# EasyEDA Pro project backup.epro, board PCB
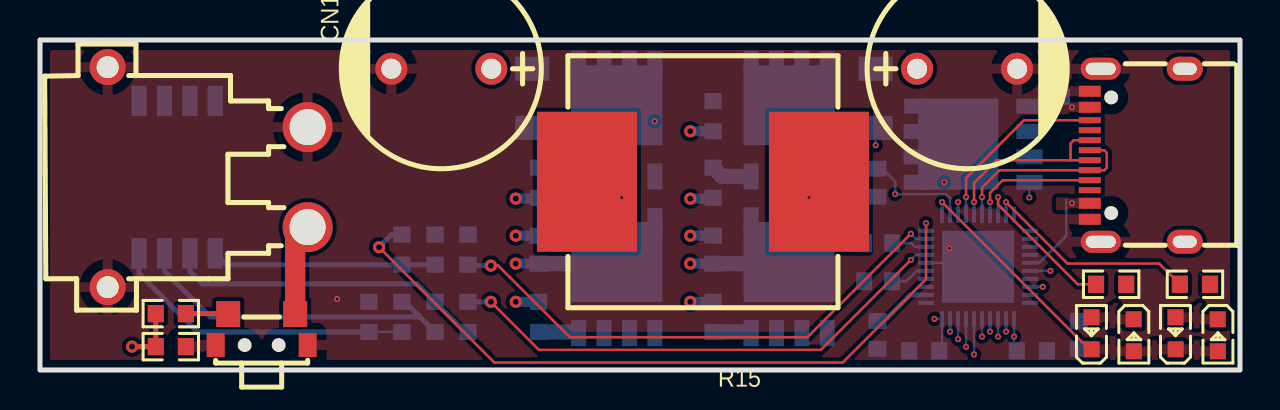
[diagram p16: board, top side]
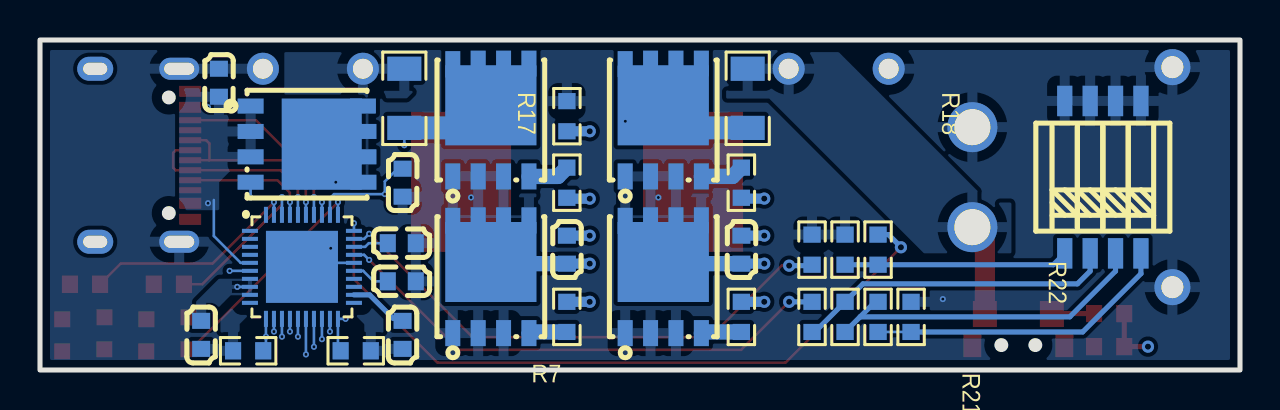
[diagram p17: board, bottom side, seen from below]

Outline 60 x 16.5 mm; copper layers: Top Layer, VCC/SIGANL, GND, Bottom Layer. Coordinates in mm from the lower left corner of the outline.
Outline path: rectangle 0,16.5 60,0
Stack: Top Layer 0.035mm 外层铜厚1oz / Dielectric1 0.2104mm 7628 RC49% 8.6mil / VCC/SIGANL 0.0152mm 内层铜厚 / Dielectric2 1.065mm 1.1mm H/HOZ 含铜 / GND 0.0152mm 内层铜厚 / Dielectric3 0.2104mm 7628 RC49% 8.6mil / Bottom Layer 0.035mm 外层铜厚1oz

## Design rules (mm)
template: 自定义配置
spacing copperThickness1oz: track to track 0.102, other pairs 0.152 to 0.3
spacing copperThickness2oz: track to track 0.203, other pairs 0.152 to 0.3
spacing 6mil (default): track to track 0.102, other pairs 0.152 to 0.152
track width copperThickness1oz (default): min 0.127, default 0.254, max 2.54
track width copperThickness2oz: min 0.203, default 0.254, max 2.54
track width 10mil: min 0.254, default 0.254, max 2.54
track width 20mil: min 0.508, default 0.508, max 2.54
differential pair differentialPair (default): width min 0.127, default 0.254, max 2.54; gap min 0.152, default 0.152
differential pair err=5mil: width min 0.127, default 0.254, max 2.54; gap min 0.152, default 0.254
via viaSize: diameter min 0.5, default 0.61, max 10; hole min 0.3, default 0.305, max 6.299
via 12-24: diameter min 0.5, default 0.61, max 10; hole min 0.3, default 0.305, max 6.299
via 6-12 (default): diameter min 0.305, default 0.305, max 10; hole min 0.152, default 0.152, max 6.299

## Placement (name value [footprint] x y rotation side)
C20  2.2uF  [C0603]  41.91 4.44 180 bottom
C22  100nF  [C0603]  41.87 9.37 270 bottom
C23  2.2uF  [C0603]  41.91 6.34 180 bottom
C29  470nF  [C0603]  51.94 1.76 90 bottom
C30  470nF  [C0603]  41.87 1.76 90 bottom
C35  1000uF  [CAP-TH_BD10.0-P5.00-D0.6-FD-A]  46.35 15.06 0 top
C36  470nF  [C0603]  33.66 6.02 270 bottom
C37  470nF  [C0603]  24.93 6.02 270 bottom
C38  1000uF  [CAP-TH_BD10.0-P5.00-D0.6-FD-A]  20.07 15.06 180 top
C39  22uF  [C0603]  51.05 14.36 270 bottom
CN1  XT30PW-M  [CONN-TH_XT30PW-M]  8.38 9.64 270 top
L1  10uH  [IND-SMD_L12.6-W13.5]  33.15 9.41 180 top
LED1  NCD0603R1  [LED0603-RD_RED]  52.58 1.83 90 top
LED2  NCD0603R1  [LED0603-RD_RED]  54.69 1.73 270 top
LED3  NCD0603R1  [LED0603-RD_RED]  56.78 1.83 90 top
LED4  NCD0603R1  [LED0603-RD_RED]  58.89 1.73 270 top
Q2  BSC0702LS  [PG-TDSON-8_L5.0-W6.0-P1.27-BL-EP]  46.65 11.29 270 bottom
Q3  BSC0702LS  [PG-TDSON-8_L5.0-W6.0-P1.27-BL-EP]  37.46 12.5 180 bottom
Q4  BSC0702LS  [PG-TDSON-8_L5.0-W6.0-P1.27-BL-EP]  28.84 4.66 180 bottom
Q5  BSC0702LS  [PG-TDSON-8_L5.0-W6.0-P1.27-BL-EP]  37.46 4.66 180 bottom
Q6  BSC0702LS  [PG-TDSON-8_L5.0-W6.0-P1.27-BL-EP]  28.84 12.5 180 bottom
R7  51Ω  [R0603]  49.59 0.96 0 bottom
R8  5mΩ  [R1206]  41.78 13.58 270 bottom
R9  10Ω  [R0603]  44.21 0.96 180 bottom
R10  5mΩ  [R1206]  24.62 13.58 90 bottom
R11  100Ω  [R0603]  53.56 4.29 0 top
R12  100Ω  [R0603]  57.75 4.29 0 top
R15  43kΩ  [R0603]  6.54 2.82 180 top
R16  10kΩ  [R0603]  6.54 1.17 180 top
R17  27kΩ  [R0603]  21.4 6.02 90 bottom
R18  3.6K  [R0603]  18.1 6.02 270 bottom
R19  5.5K  [R0603]  19.75 6.02 90 bottom
R20  6.2K  [R0603]  21.4 2.66 270 bottom
R21  2.9K  [R0603]  19.75 2.66 270 bottom
R22  4.9K  [R0603]  18.1 2.66 270 bottom
R23  5K  [R0603]  16.45 2.66 90 bottom
R24  NCP18XH103F03RB  [R0603]  33.66 12.69 90 bottom
R25  2Ω  [R0603]  33.66 9.37 90 bottom
R26  2Ω  [R0603]  33.66 2.66 270 bottom
R27  2Ω  [R0603]  24.93 9.37 270 bottom
R28  2Ω  [R0603]  24.93 2.66 90 bottom
SW1  TS24CA  [SW-SMD_TS24CA]  11.08 2.02 180 top
SW2  DSHP04TSGET  [SW-SMD_8P-L6.7-W5.4-P1.27-LS8.4]  6.86 9.64 180 bottom
U1  -  [IP2366]  49.4 2.66 180 bottom
USB1  TYPE-C 16PIN 2MD(073)  [USB-C-SMD_TYPE-C-6PIN-2MD-073]  54.86 10.74 90 top

## Footprints (pads in the part's own frame, mm; a bottom-side part is the same pattern mirrored in y, then rotated)
C0603
  rect 0.8x0.9 smd: 1(-0.7,0) 2(0.7,0)
CAP-TH_BD10.0-P5.00-D0.6-FD-A
  round 1.6 hole 1: 1(-2.5,0) 2(2.5,0)
CONN-TH_XT30PW-M
  round 2.5 hole 1.8: 1(-2.5,5) 2(2.5,5)
  round 1.8 hole 1.1: 3(5.5,-5) 4(-5.5,-5)
IND-SMD_L12.6-W13.5
  rect 5x7 smd: 1(-5.8,0) 2(5.8,0)
IP2366
  rect 0.8x0.2 smd: 1(-0.1,4.3) 2(-0.1,3.9) 3(-0.1,3.5) 4(-0.1,3.1) 5(-0.1,2.7) 6(-0.1,2.3) 7(-0.1,1.9) 8(-0.1,1.5) 9(-0.1,1.1) 10(-0.1,0.7) 21(5.1,0.7) 22(5.1,1.1) 23(5.1,1.5) 24(5.1,1.9) 25(5.1,2.3) 26(5.1,2.7) 27(5.1,3.1) 28(5.1,3.5) 29(5.1,3.9) 30(5.1,4.3)
  rect 0.2x0.8 smd: 11(0.7,-0.1) 12(1.1,-0.1) 13(1.5,-0.1) 14(1.9,-0.1) 15(2.3,-0.1) 16(2.7,-0.1) 17(3.1,-0.1) 18(3.5,-0.1) 19(3.9,-0.1) 20(4.3,-0.1) 31(4.3,5.1) 32(3.9,5.1) 33(3.5,5.1) 34(3.1,5.1) 35(2.7,5.1) 36(2.3,5.1) 37(1.9,5.1) 38(1.5,5.1) 39(1.1,5.1) 40(0.7,5.1)
  rect 3.6x3.6 smd: 41(2.5,2.5)
LED0603-RD_RED
  rect 0.8x0.8 smd: 1(-0.799,-0.004) 2(0.799,0.004)
PG-TDSON-8_L5.0-W6.0-P1.27-BL-EP
  rect 0.75x1.3 smd: 1(-1.905,-2.82) 2(-0.635,-2.82) 3(0.635,-2.82) 4(1.905,-2.82) 5(1.905,2.82) 6(0.635,2.82) 7(-0.635,2.82) 8(-1.905,2.794)
  rect 4.56x4 smd: 8(0,0.737)
R0603
  rect 0.806x0.864 smd: 1(-0.753,0) 2(0.753,0)
R1206
  rect 1.208x1.701 smd: 1(-1.479,0) 2(1.479,0)
SW-SMD_8P-L6.7-W5.4-P1.27-LS8.4
  rect 0.762x1.524 smd: 1(-1.905,-3.81) 2(-0.635,-3.81) 3(0.635,-3.81) 4(1.905,-3.81) 5(1.905,3.81) 6(0.635,3.81) 7(-0.635,3.81) 8(-1.905,3.81)
SW-SMD_TS24CA
  rect 0.9x1.2 smd: 1(-2.3,0.775) 2(2.3,0.775)
  rect 1.2x1.3 smd: 3(-1.675,-0.775) 4(1.675,-0.775)
USB-C-SMD_TYPE-C-6PIN-2MD-073
  rect 0.55x1.1 smd: 1(-3.2,2.375) 2(-2.4,2.375) 11(2.4,2.375) 12(3.2,2.375)
  rect 0.3x1.1 smd: 3(-1.75,2.375) 4(-1.25,2.375) 5(-0.75,2.375) 6(-0.25,2.375) 7(0.25,2.375) 8(0.75,2.375) 9(1.25,2.375) 10(1.75,2.375)
  oval 1.1x2 hole 0.6x1.5: 13(-4.325,1.825) 14(4.325,1.825)
  oval 1.2x1.8 hole 0.6x1.2: 13(-4.325,-2.375) 14(4.325,-2.375)

## Nets
As in the schematic, except:
$C30_2: C30.2 U1.22 U1.23
BAT: C38.1 CN1.2 R10.2 SW1.3

Pads without a net: U1 1 2 3 4 24 40; USB1 3 9

## Via types
v1: diameter 0.305, hole 0.152, Top Layer to Bottom Layer, 34 vias
v2: diameter 0.61, hole 0.305, Top Layer to Bottom Layer, 13 vias

## Routing (per net, layer and track width the routed paths; a pad name or vN(x,y) marks a point on that pad's centre or on a via; arc(x,y) is an arc through that point)
GND: length 2.7
  Bottom Layer w0.127: U1.41 46.7,5.36 U1.26
  vias: v1(14.86,3.55) v1(45.47,6.09)
VBUS: length 4.2
  Bottom Layer w0.127: 51.31,8.5 51.31,6.7 49.97,5.36 U1.5
  vias: v1(51.6,13.14) v1(51.6,8.34)
3S: length 16.1
  Bottom Layer w0.254: SW2.2 7.49,4.94 8.13,4.31 18.85,4.31 R21.1 21.25,1.9 R20.2
4S: length 16.9
  Bottom Layer w0.254: 18.99,2.66 8.51,2.66 6.22,4.94 SW2.3 ; 18.99,2.66 18.24,3.41 R22.1 ; 18.99,2.66 R21.2
5S: length 15.4
  Bottom Layer w0.127: R23.1 R22.2
  Bottom Layer w0.254: R23.1 7.87,1.9 4.95,4.82 SW2.4
$C20_1: length 1.9
  Bottom Layer w0.127: C20.1 43.32,4.44 43.84,4.96 U1.25
$C23_1: length 1.8
  Bottom Layer w0.127: C23.1 43.56,6.34 43.74,6.16 U1.28
$C29_2: length 9.5
  VCC/SIGANL w0.127: v1(45.21,9.39) 47.88,9.39 50.14,7.13 v1(50.14,4.16)
  Bottom Layer w0.127: v1(50.14,4.16) U1.8
$C30_2: length 2.9
  Bottom Layer w0.254: U1.22 43.52,3.76 42.35,2.58 41.87,2.58
$C36_1: length 20.4
  VCC/SIGANL w0.127: v2(32.51,6.72) 32.51,6.05 34.64,3.93 46.48,3.93 47.9,2.51 v1(47.9,1.67)
  Bottom Layer w0.127: v1(47.9,1.67) U1.13
  Bottom Layer w0.508: v2(32.51,6.72) C36.1
$C36_2: length 22.5
  VCC/SIGANL w0.127: v2(32.51,5.32) 32.51,4.82 33.78,3.55 46.23,3.55 47.5,2.27 v1(47.5,1.92)
  Bottom Layer w0.127: v1(47.5,1.92) U1.14
  Bottom Layer w0.508: C36.2 v2(32.51,5.32)
  Bottom Layer w0.762: Q5.8 37.38,5.32 C36.2
  vias: v1(38.45,8.63)
$C37_1: length 26.8
  VCC/SIGANL w0.127: v2(23.79,6.72) 23.79,6.05 28.3,1.54 v1(45.9,1.54)
  Bottom Layer w0.127: v1(45.9,1.54) U1.18
  Bottom Layer w0.508: v2(23.79,6.72) C37.1
$C37_2: length 31
  VCC/SIGANL w0.127: v2(23.79,5.32) 23.79,4.78 27.41,1.16 v1(46.3,1.16)
  Bottom Layer w0.127: v1(46.3,1.16) U1.17
  Bottom Layer w0.508: v2(23.79,5.32) C37.2
  Bottom Layer w0.762: Q4.8 28.75,5.32 C37.2
  vias: v1(29.08,8.63)
$Q2_4: length 5.9
  VCC/SIGANL w0.127: v1(49.47,8.63) 50.52,7.58 v1(50.52,4.96)
  Bottom Layer w0.127: U1.6 v1(50.52,4.96) ; v1(49.47,8.63) Q2.4
$Q3_4: length 2.1
  Bottom Layer w0.762: R25.2 34.1,9.68 Q3.4
$Q3_5: length 19.6
  VCC/SIGANL w0.127: v1(41.78,11.24) 41.78,10.79 48.7,3.87 v1(48.7,1.67)
  Bottom Layer w0.127: v1(41.78,11.24) R8.2 ; 48.84,1.09 48.7,1.23 v1(48.7,1.67) U1.11
  Bottom Layer w1.143: Q3.8 38.59,12.1 R8.2
$Q4_4: length 2
  Bottom Layer w0.762: 26.93,1.84 26.87,1.9 R28.1
$Q5_4: length 1.9
  Bottom Layer w0.762: R26.2 35.49,1.9 35.55,1.84
$Q6_4: length 2.2
  Bottom Layer w0.762: R27.1 25.37,9.68 Q6.4
$Q6_5: length 29.5
  VCC/SIGANL w0.127: v1(30.73,12.44) 31.88,11.29 31.88,3.31 32.63,2.56 v1(44.72,2.56)
  Bottom Layer w0.127: R9.1 45.1,1.1 U1.20 v1(44.72,2.56)
  Bottom Layer w1.143: R10.1 27.71,12.1 Q6.8
$R15_1: length 2.1
  Top Layer w0.254: R15.1 9.39,2.82 SW1.4
$R17_1: length 26.7
  Top Layer w0.127: v2(22.54,5.22) 22.91,5.22 26.49,1.64 38.37,1.64 v1(43.54,6.81)
  Bottom Layer w0.127: U1.29 43.79,6.56 v1(43.54,6.81)
  Bottom Layer w0.254: v2(22.54,5.22) 21.45,5.22 R17.1
BAT: length 4.6
  Top Layer w1.016: CN1.2 12.76,6.52 SW1.3
BAT_NUM: length 25.9
  Top Layer w0.127: v1(43.54,5.5) 39.04,1.01 24.94,1.01 v2(22.54,3.41)
  Bottom Layer w0.127: v1(43.54,5.5) 43.79,5.76 U1.27
  Bottom Layer w0.254: v2(22.54,3.41) R20.1
CC1: length 6.3
  Top Layer w0.127: v1(47.5,8.39) 47.5,8.86 48.13,9.49 USB1.4
  Bottom Layer w0.127: v1(47.5,8.39) U1.37
CC2: length 9.2
  Top Layer w0.127: v1(46.3,8.65) 46.3,9.59 49.2,12.49 USB1.10
  Bottom Layer w0.127: v1(46.3,8.65) U1.34
DM: length 9.7
  Top Layer w0.127: USB1.7 53.21,10.99 53.34,10.86 53.34,10.11 53.21,9.99 USB1.5 47.97,9.99 47.1,9.12 v1(47.1,8.65)
  Bottom Layer w0.127: v1(47.1,8.65) U1.36
DP: length 9.7
  Top Layer w0.127: v1(46.7,8.39) 46.7,9.36 47.84,10.49 51.53,10.49 ; 51.53,10.49 51.53,11.33 51.69,11.49 USB1.8 ; 51.53,10.49 USB1.6
  Bottom Layer w0.127: v1(46.7,8.39) U1.35
EN: length 57.3
  Top Layer w0.254: R15.2 R16.2 v2(4.6,1.17)
  VCC/SIGANL w0.127: v2(4.6,1.17) 5.27,0.5 10.92,0.5 11.05,0.37 48.51,0.37 49.15,1.01 49.15,5.15 v1(45.9,8.39)
  Bottom Layer w0.127: v1(45.9,8.39) U1.33
HG1: length 21.5
  VCC/SIGANL w0.127: v1(48.3,1.92) 48.3,2.74 46.74,4.31 35.66,4.31 32.51,7.45 v2(32.51,8.57)
  Bottom Layer w0.127: v1(48.3,1.92) U1.12
  Bottom Layer w0.508: v2(32.51,8.57) 33.61,8.57 R25.1
HG2: length 26.9
  VCC/SIGANL w0.127: v2(23.79,8.57) 23.79,7.45 29.32,1.92 v1(45.5,1.92)
  Bottom Layer w0.127: v1(45.5,1.92) U1.19
  Bottom Layer w0.508: R27.2 24.89,8.57 v2(23.79,8.57)
LED1: length 11
  Top Layer w0.127: R12.1 55.96,5.32 51.37,5.32 v1(48.3,8.39)
  Bottom Layer w0.127: v1(48.3,8.39) U1.39
LED2: length 7.8
  Top Layer w0.127: R11.1 51.89,4.29 47.9,8.27 v1(47.9,8.65)
  Bottom Layer w0.127: v1(47.9,8.65) U1.38
LED3: length 11.2
  Top Layer w0.127: 52.58,1.03 52.46,1.03 v1(45.1,8.39)
  Bottom Layer w0.127: U1.31 v1(45.1,8.39)
LG1: length 17.6
  VCC/SIGANL w0.127: v2(32.51,3.41) 32.76,3.17 45.97,3.17 47.1,2.04 v1(47.1,1.67)
  Bottom Layer w0.127: v1(47.1,1.67) U1.15
  Bottom Layer w0.508: v2(32.51,3.41) R26.1
LG2: length 26.9
  VCC/SIGANL w0.127: v2(23.79,3.41) 26.42,0.78 v1(46.7,0.78)
  Bottom Layer w0.127: v1(46.7,0.78) U1.16
  Bottom Layer w0.508: v2(23.79,3.41) R28.2
NTC: length 25
  VCC/SIGANL w0.127: v1(42.76,8.8) 42.76,5.54 41.91,4.69 37.13,4.69 32.51,9.31 v2(32.51,11.94)
  Bottom Layer w0.127: C22.1 42.12,10.07 42.76,9.43 v1(42.76,8.8) ; U1.32 45.5,8.59 45.3,8.79 42.76,8.79
  Bottom Layer w0.508: v2(32.51,11.94) R24.1
SET: length 11.2
  Bottom Layer w0.254: R19.1 R18.2 9.33,5.26 SW2.1
VSET: length 36.1
  Top Layer w0.127: v1(44.3,7.34) 44.3,4.54 40.13,0.37 22.72,0.37 v2(16.95,6.14)
  Bottom Layer w0.127: U1.30 v1(44.3,7.34)
  Bottom Layer w0.254: v2(16.95,6.14) 16.95,6.15 17.58,6.77 R18.1

## Copper pours and planes (outline as drawn; the poured copper is in the pictures)
GND on Top Layer: -5.21,22.34 61.98,22.34 61.98,-2.68 -5.21,-2.68
GND on Bottom Layer: -3.81,21.71 62.74,21.71 62.74,-3.82 -3.81,-3.82
VBUS on Top Layer: 50.8,13.43 53.09,13.43 53.09,12.79 50.8,12.79
VBUS on Top Layer: 50.8,8.63 53.09,8.63 53.09,7.99 50.8,7.99
VBUS on Bottom Layer: 48.77,14.08 53.04,14.08 53.04,7.99 51.04,7.99 51.04,9.4 50.16,10.28 48.77,10.28
$C29_1 on Bottom Layer: 50.02,2.29 49.59,2.72 49.07,2.72 49.07,3.36 50.16,3.36 50.98,2.55 50.98,1.62 52.66,1.62 52.66,0.3 50.02,0.3
$C29_2 on Bottom Layer: 40.7,15.89 40.7,14.53 41.66,13.58 43.21,13.58 43.21,9.01 47.79,9.01 47.79,15.89
$C29_2 on Bottom Layer: 49.02,4.56 51.05,4.56 52.65,2.96 52.65,2.16 51.23,2.16 51.23,2.96 50.46,3.74 49.02,3.74
$C30_1 on Bottom Layer: 43.79,2.29 44.21,2.72 44.73,2.72 44.73,3.36 43.64,3.36 42.83,2.55 42.83,1.62 41.15,1.62 41.15,0.3 43.79,0.3
$C36_2 on Bottom Layer: 35.18,10.33 39.74,10.33 39.74,3.42 35.18,3.42
$C37_2 on Bottom Layer: 26.56,10.33 31.12,10.33 31.12,3.4 26.56,3.4
$LED1_2 on Top Layer: 53.98,4.95 53.98,3.63 53.58,3.22 51.82,3.22 51.82,2.07 53.74,2.07 53.94,1.87 55.44,1.87 55.44,2.92 55.14,3.22 54.94,3.63 54.94,4.95
$LED3_2 on Top Layer: 58.19,4.95 58.19,3.63 57.78,3.22 56.03,3.22 56.03,2.07 57.94,2.07 58.14,1.87 59.64,1.87 59.64,2.92 59.34,3.22 59.15,3.63 59.15,4.95
BAT on Bottom Layer: 11.43,8.37 11.43,5.83 15.8,5.83 23.54,13.57 25.69,13.57 25.69,15.89 20.07,15.89 12.54,8.37
LED3 on Top Layer: 51.82,1.69 53.74,1.69 53.94,1.49 55.83,1.49 56.03,1.69 57.53,1.69 57.73,1.49 59.65,1.49 59.65,0.34 52.12,0.34 51.82,0.64

Small or netless copper shapes (teardrops, artwork), in the pictures only: 1 on Bottom Layer
